# EAGLE design RTC (EAGLE 7.3.0)
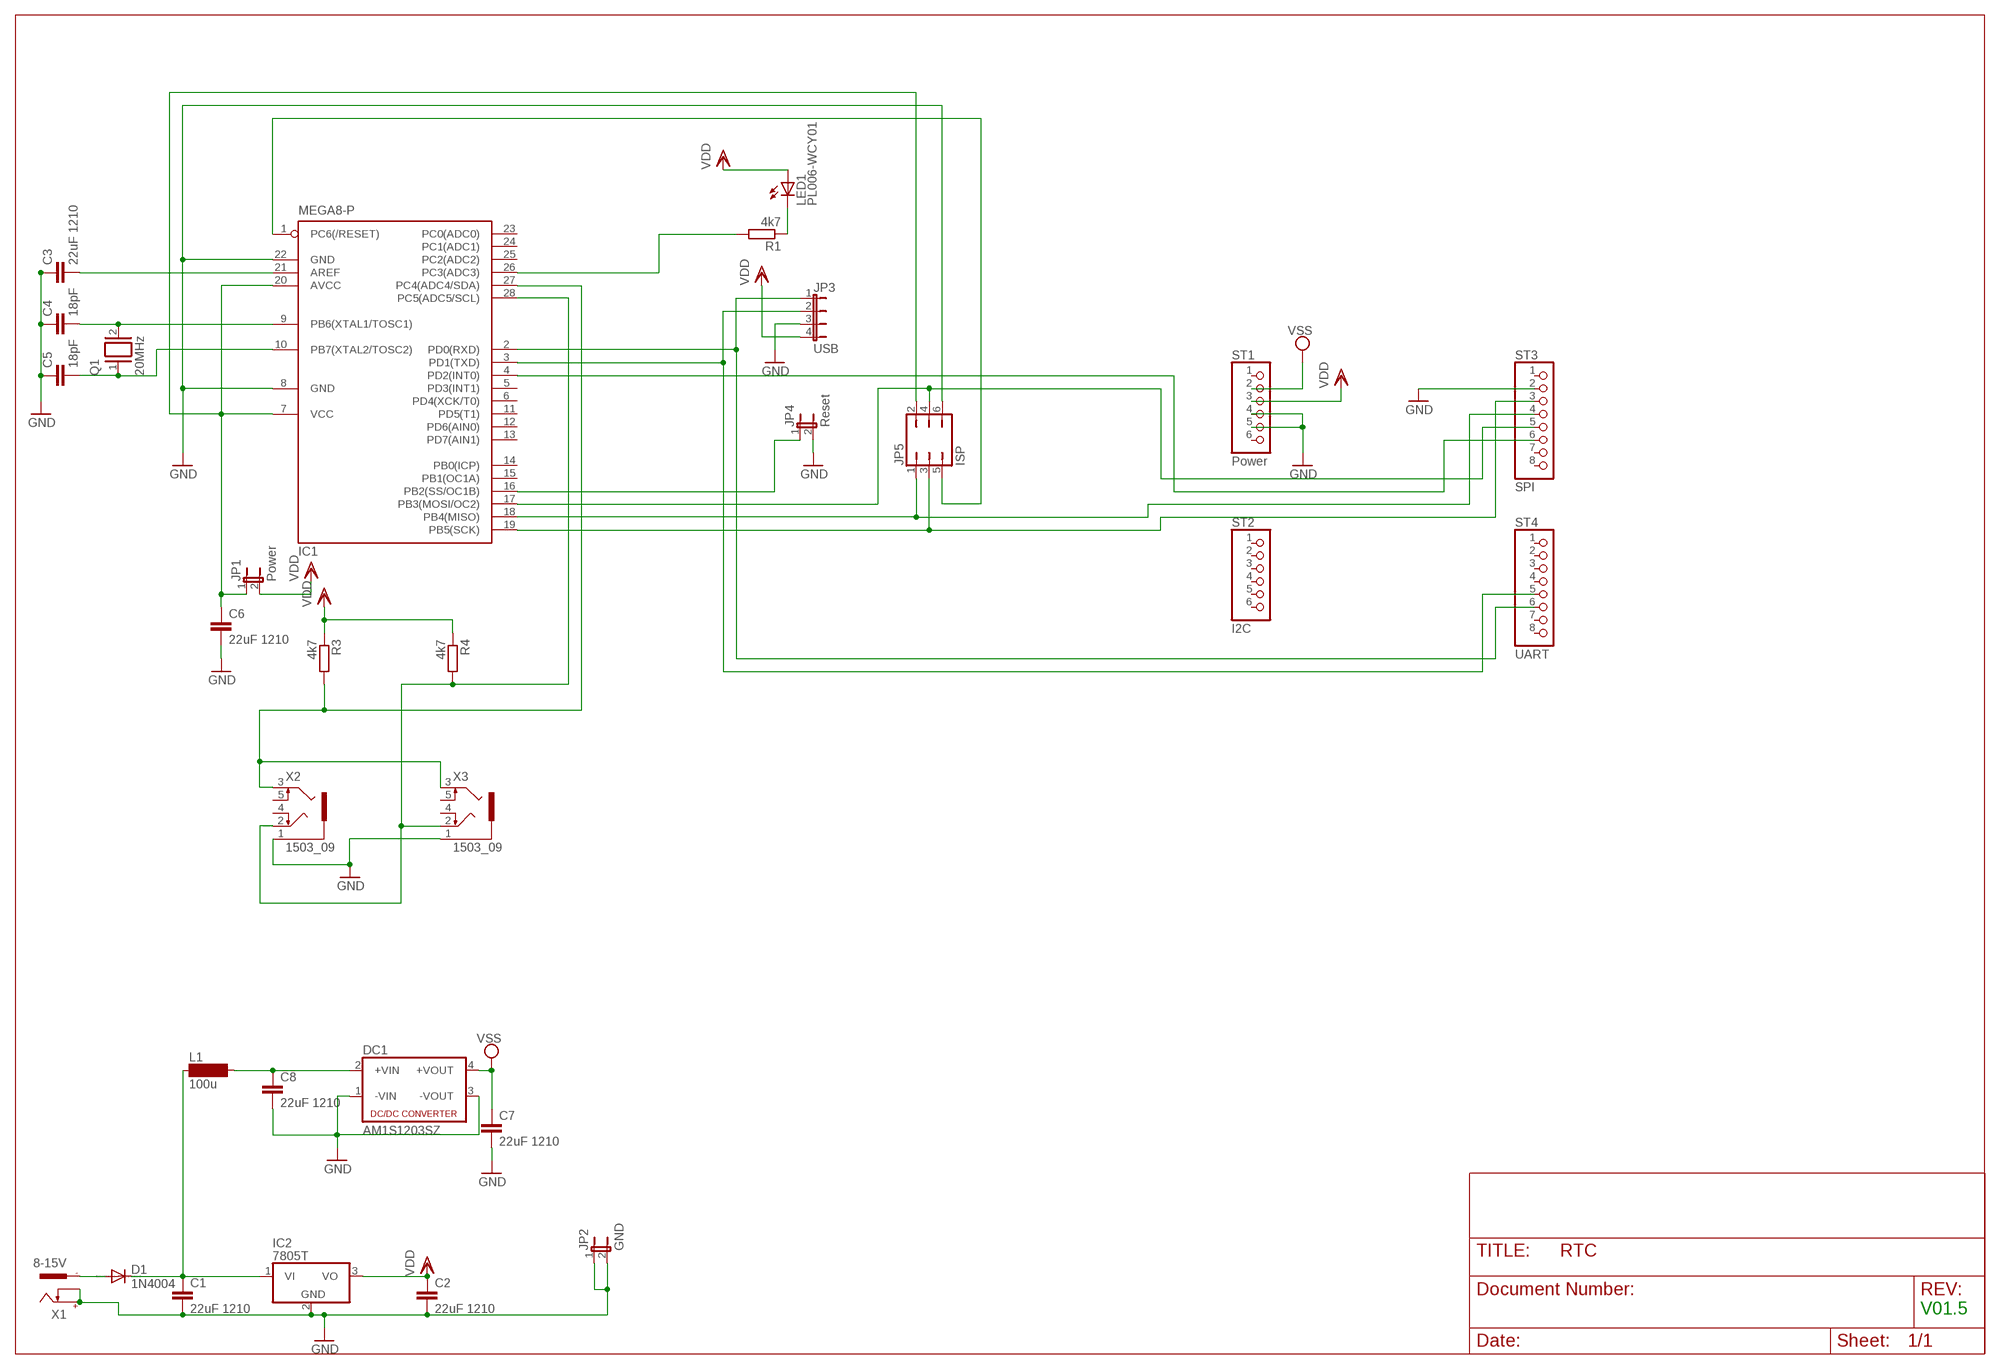
[diagram p0: schematic, sheet 1]

## Parts
C1  22uF 1210  C-EUC1206  [C1206]
C2  22uF 1210  C-EUC1206  [C1206]
C3  22uF 1210  C-EUC1206  [C1206]
C4  18pF  C-EU025-025X050  [C025-025X050]
C5  18pF  C-EU025-025X050  [C025-025X050]
C6  22uF 1210  C-EUC1206  [C1206]
C7  22uF 1210  C-EUC1206  [C1206]
C8  22uF 1210  C-EUC1206  [C1206]
D1  1N4004  [DO41-10]
DC1  AM1S1203SZ  NME  [NME]
IC1  MEGA8-P  [DIL28-3]
IC2  7805T  [TO220H]
JP1  Power  JP1E  [JP1]
JP2  GND  JP1E  [JP1]
JP3  USB  JP4E  [JP4]
JP4  Reset  JP1E  [JP1]
JP5  ISP  JP3Q  [JP3Q]
L1  100u  MS85  [MS85]
LED1  PL006-WCY01  [SOT23]
Q1  20MHz  XTAL/S  [QS]
R1  4k7  R-EU_M1206  [M1206]
R3  4k7  R-EU_R1206  [R1206]
R4  4k7  R-EU_R1206  [R1206]
ST1  Power  PINHD-1X6  [1X06]
ST2  I2C  PINHD-1X6  [1X06]
ST3  SPI  PINHD-1X8  [1X08]
ST4  UART  PINHD-1X8  [1X08]
X1  8-15V  737992-55  [737992-5]
X2  1503_09  [1503_09]
X3  1503_09  [1503_09]

## Nets
GND: C1.2 C2.2 C3.1 C4.1 C5.1 C6.2 C7.2 C8.2 DC1.1(-VIN) DC1.3(-VOUT) IC1.8(GND) IC1.22(GND) IC2.2(GND) JP2.1 JP2.2 JP3.3 JP4.2 JP5.6 ST1.4 ST1.5 ST3.2 X1.+ X1.K X2.1 X3.1
N$1: IC1.26(PC3(ADC3)) R1.2
N$2: IC1.2(PD0(RXD)) JP3.1 ST4.6
N$3: C8.1 DC1.2(+VIN) L1.2
N$4: IC1.4(PD2(INT0)) ST3.6
N$5: IC1.27(PC4(ADC4/SDA)) R3.2 X2.3 X3.3
N$6: IC1.16(PB2(SS/OC1B)) JP4.1
N$12: IC1.3(PD1(TXD)) JP3.2 ST4.5
N$15: IC1.18(PB4(MISO)) JP5.1 ST3.4
N$18: IC1.1(PC6(/RESET)) JP5.5
N$19: C4.2 IC1.9(PB6(XTAL1/TOSC1)) Q1.2
N$20: IC1.19(PB5(SCK)) JP5.3 ST3.3
N$22: IC1.28(PC5(ADC5/SCL)) R4.2 X2.2 X3.2
N$27: D1.A X1.-1
N$28: IC1.17(PB3(MOSI/OC2)) JP5.4 ST3.5
N$33: C1.1 D1.C IC2.1(VI) L1.1
N$35: C3.2 IC1.21(AREF)
N$37: C5.2 IC1.10(PB7(XTAL2/TOSC2)) Q1.1
N$44: C6.1 IC1.7(VCC) IC1.20(AVCC) JP1.1 JP5.2
N$50: LED1.3(C) R1.1
VDD: C2.1 IC2.3(VO) JP1.2 JP3.4 LED1.1(A) R3.1 R4.1 ST1.3
VSS: C7.1 DC1.4(+VOUT) ST1.2
Unconnected: IC1.5(PD3(INT1)) IC1.6(PD4(XCK/T0)) IC1.11(PD5(T1)) IC1.12(PD6(AIN0)) IC1.13(PD7(AIN1)) IC1.14(PB0(ICP)) IC1.15(PB1(OC1A)) IC1.23(PC0(ADC0)) IC1.24(PC1(ADC1)) IC1.25(PC2(ADC2)) ST1.1 ST1.6 ST2.1 ST2.2 ST2.3 ST2.4 ST2.5 ST2.6 ST3.1 ST3.7 ST3.8 ST4.1 ST4.2 ST4.3 ST4.4 ST4.7 ST4.8 X1.-2 X2.4 X2.5 X3.4 X3.5

## Notes on the sheet
- V01.5

## Library data of the parts
C1-C3 C6-C8 = rcl:C-EU: CAPACITOR, European symbol
C4 C5 = resistor:C-EU: CAPACITOR, European symbol
D1 = diode:1N4004: DIODE general purpose rectifier, 1 A
DC1 = dc-dc-converter:NME: DC-DC CONVERTER; MF: C & D TECHNOLOGIES, INC; MPN: NME1205D; OC_FARNELL: 1021466; OC_NEWARK: 98B8198
IC1 = atmel:MEGA8-P: MICROCONTROLLER 8 Kbytes FLASH, 1 kbytes SRAM, 512 bytes EEPROM, USART, 4-channel 10 bit ADC, 2-channel 8 bit ADC Pin compatible with Atmega48, ATMega88, ATMega168 Source: avr.lbr; OC_FARNELL: unknown; OC_NEWARK: unknown
IC2 = linear:78*: Positive VOLTAGE REGULATOR Source: http://cache.national.com/ds/LM/LM78L05.pdf http://www.fairchildsemi.com/ds/LM/LM7805.pdf
JP1 JP2 JP4 = jumper:JP1E: JUMPER
JP3 = jumper:JP4E: JUMPER
JP5 = jumper:JP3Q: JUMPER
L1 = inductor-neosid:MS85: INDUCTOR SMD power inductor; OC_FARNELL: unknown; OC_NEWARK: unknown
LED1 = led:PL006*: PLH006 Series SMD LED SOT23 PLH006-WCR21 Super Red PLH006-WCR12 High Eff Red PLH006-WCG13 Green PLH006-WCY01 Yellow www.p-tec.net Source: http://www.wittig-electronic.de/PTEC/PL006Series.pdf
Q1 = special:XTAL/S: CRYSTAL
R1 R3 R4 = resistor:R-EU_: RESISTOR, European symbol
ST1 ST2 = pinhead:PINHD-1X6: PIN HEADER
ST3 ST4 = pinhead:PINHD-1X8: PIN HEADER
X1 = con-conrad:737992-55: FEMALE PRINT CONNECTOR DIN 45323 (34V/3A), ROKA, distributor Conrad
X2 X3 = con-lumberg:1503_09: Jack connectors according to JISC 6560, 3.5 mm Klinkeneinbaukupplung nach JISC 6560, 3,5 mm, 3-polig/ stereo, abgewinkelte Ausführung, mit 2 Öffnern und Lötaugen, für Leiterplatten Rückseitenmontage Source: http://www.lumberg.com/Produkte/PDFs/1503_09.pdf; OC_FARNELL: 1243244; OC_NEWARK: unknown

## Board
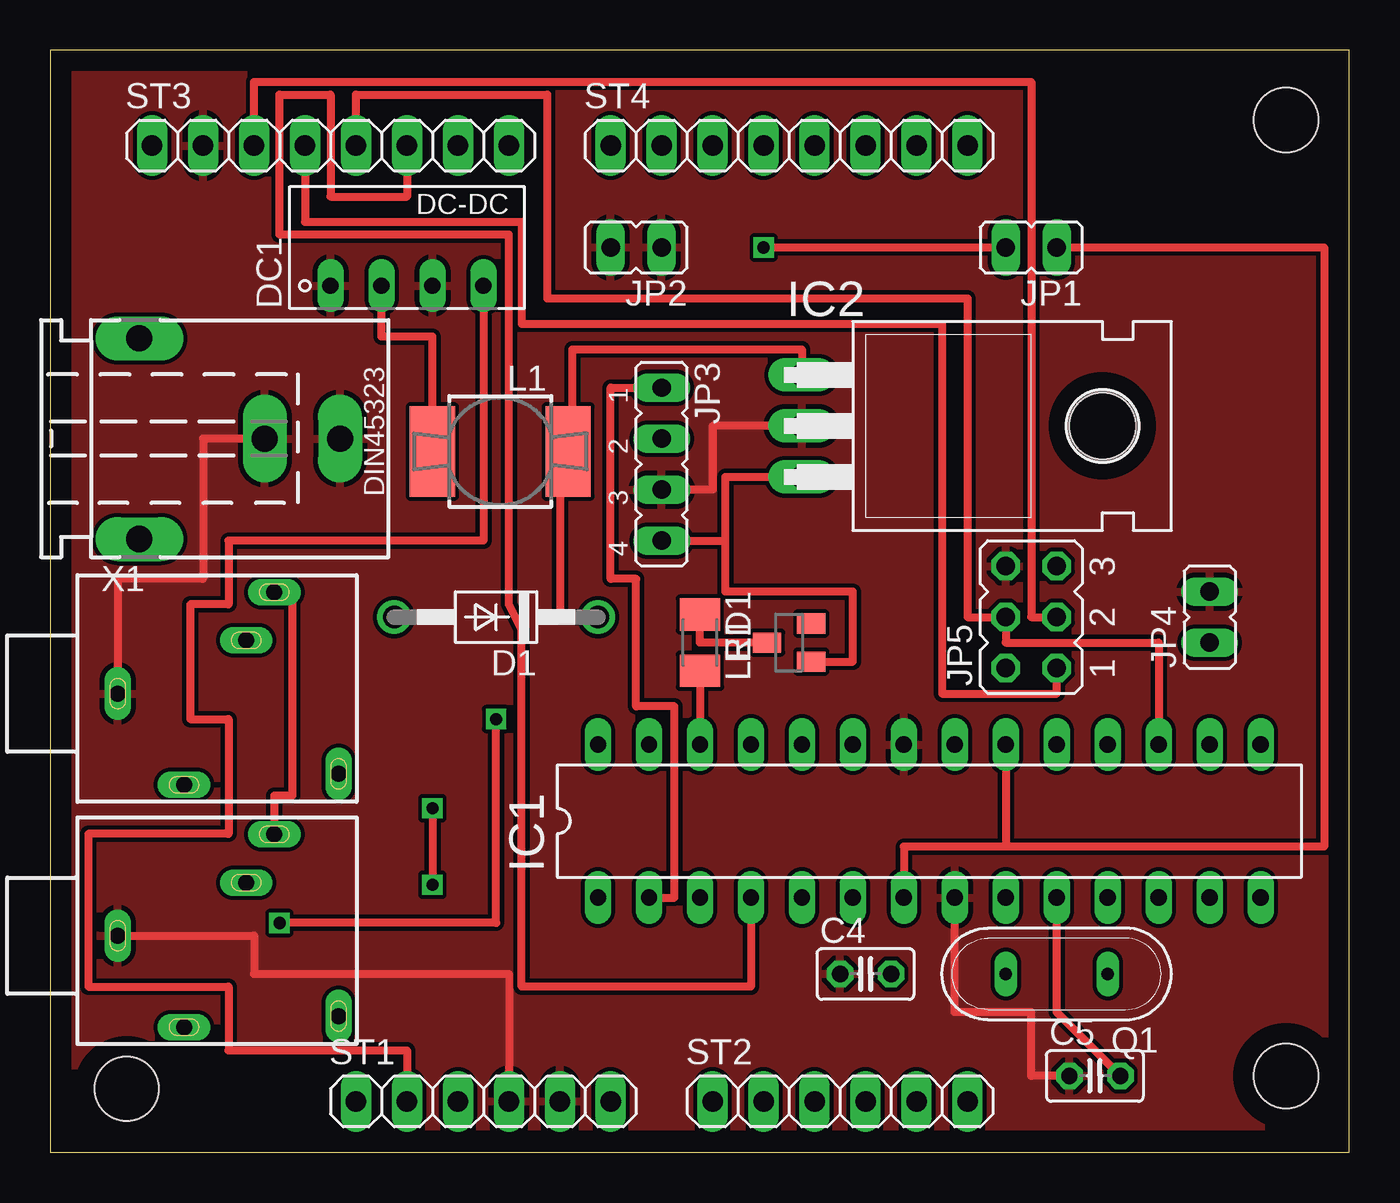
[diagram p1: board, top side]
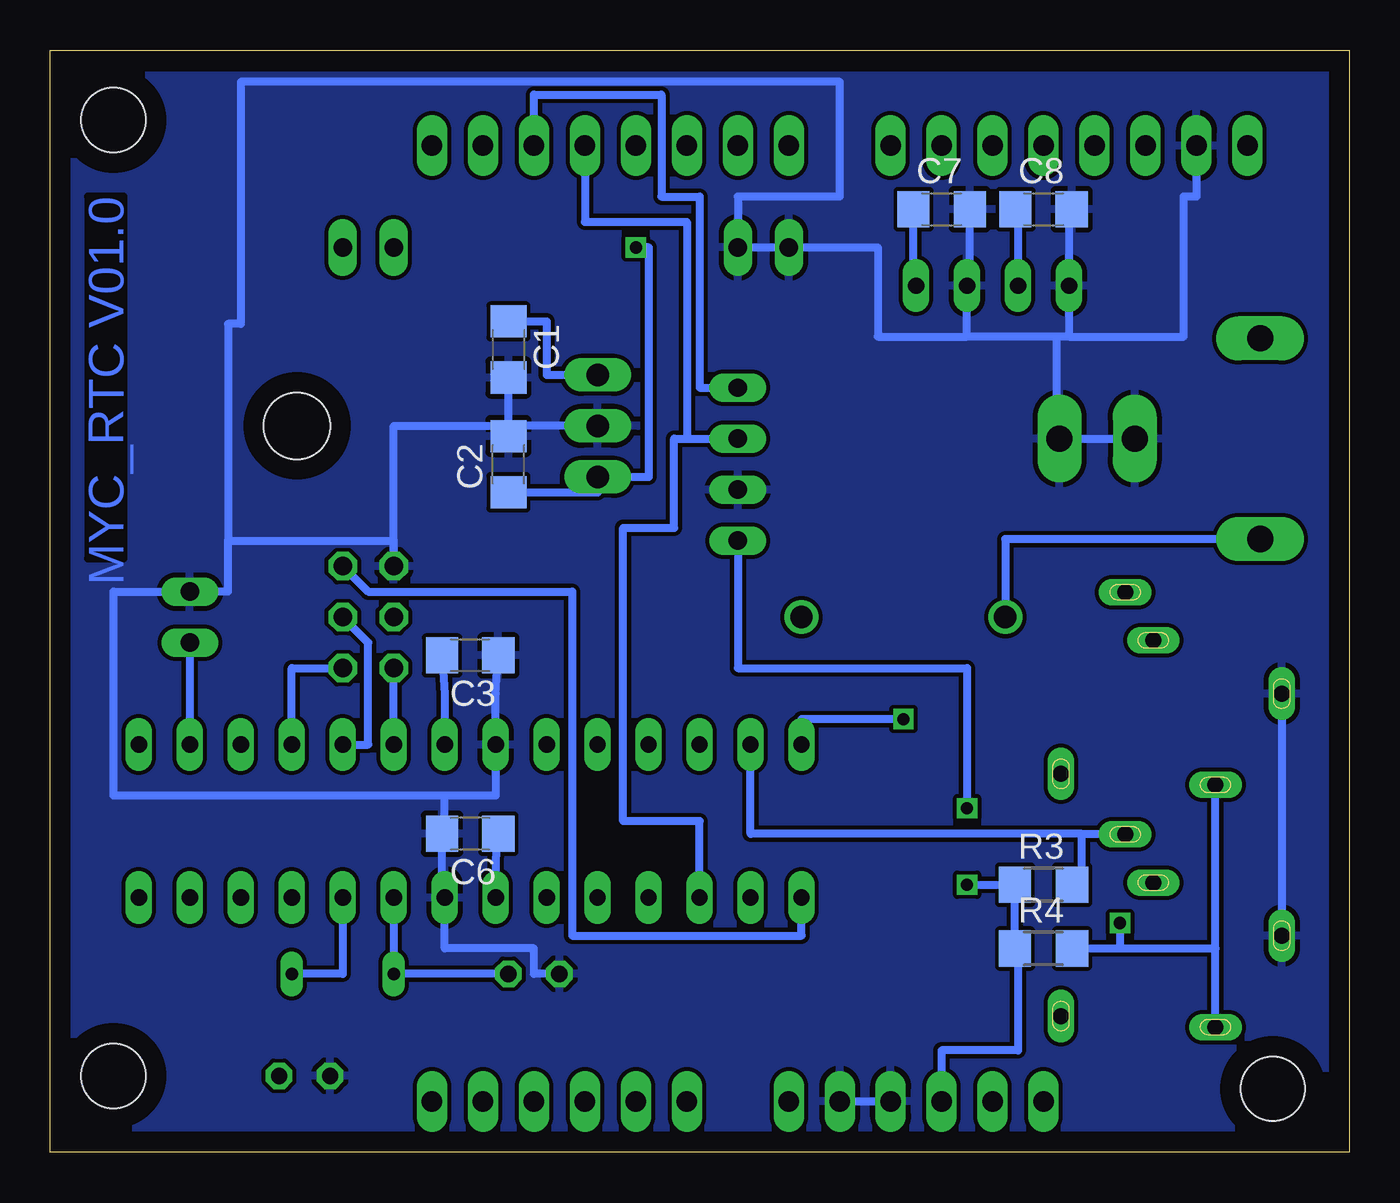
[diagram p2: board, bottom side, seen from below]

Size 64.75 x 54.91 mm. Coordinates in mm from the lower left corner, seen from the top.
Outline: 0,0 64.75,0 64.75,54.91 0,54.91 0,0
Copper layers (1*16): Top 0.035mm / dielectric 1.5mm / Bottom 0.035mm
Design rules "default": minimum track width 10mil, minimum drill 24mil, track to track 8mil, track to pad 8mil, pad to pad 8mil, via to via 8mil, smd to smd 8mil, copper to edge 40mil, drill to drill 8mil, minimum pad ring 10mil, minimum via ring 8mil, stop-mask expansion 4mil, vias tented up to drill 0mil, thermal gap 10mil
Holes 3.2 mm at 61.6,51.44 61.6,3.81 3.81,3.17

### Footprints (pad centres in the part's own frame; a part is rotated, then mirrored left to right if it is on the bottom)
C1206 = smd 1.6 x 1.8: 1 -1.4,0; 2 1.4,0
C025-025X050 = drill 0.813 octagon: 1 -1.27,0; 2 1.27,0
DO41-10 = drill 1.118: A 5.08,0; C -5.08,0
NME = drill 0.813 long: 1 0,3.81; 2 0,1.27; 3 0,-1.27; 4 0,-3.81
DIL28-3 = drill 0.813 long: 1 -16.51,-3.81; 2 -13.97,-3.81; 3 -11.43,-3.81; 4 -8.89,-3.81; 5 -6.35,-3.81; 6 -3.81,-3.81; 7 -1.27,-3.81; 8 1.27,-3.81; 9 3.81,-3.81; 10 6.35,-3.81; 11 8.89,-3.81; 12 11.43,-3.81; 13 13.97,-3.81; 14 16.51,-3.81; 15 16.51,3.81; 16 13.97,3.81; 17 11.43,3.81; 18 8.89,3.81; 19 6.35,3.81; 20 3.81,3.81; 21 1.27,3.81; 22 -1.27,3.81; 23 -3.81,3.81; 24 -6.35,3.81; 25 -8.89,3.81; 26 -11.43,3.81; 27 -13.97,3.81; 28 -16.51,3.81
TO220H = drill 1.118 long: 1 -2.54,-10.16; 2 0,-10.16; 3 2.54,-10.16 | hole 3.302: 0,4.826
JP1 = drill 0.914 long: 1 0,-1.27; 2 0,1.27
JP4 = drill 0.914 long: 1 -3.81,0; 2 -1.27,0; 3 1.27,0; 4 3.81,0
JP3Q = drill 0.914 octagon: 1 -2.54,-1.27; 2 -2.54,1.27; 3 0,-1.27; 4 0,1.27; 5 2.54,-1.27; 6 2.54,1.27
MS85 = smd 4.5 x 2.25: 1 0,-3.383; 2 0,3.383
SOT23 = smd 1 x 1.4: 1 -0.95,-1.1; 2 0.95,-1.1; 3 0,1.1
QS = drill 0.61 long: 1 -2.54,0; 2 2.54,0
M1206 = smd 1.6 x 2: 1 -1.4,0; 2 1.4,0
R1206 = smd 1.6 x 1.803: 1 -1.422,0; 2 1.422,0
1X06 = drill 1.016 long: 1 -6.35,0; 2 -3.81,0; 3 -1.27,0; 4 1.27,0; 5 3.81,0; 6 6.35,0
1X08 = drill 1.016 long: 1 -8.89,0; 2 -6.35,0; 3 -3.81,0; 4 -1.27,0; 5 1.27,0; 6 3.81,0; 7 6.35,0; 8 8.89,0
737992-5 = drill 1.3 pad 2.184 long: + 0,10; -1 5,0; -2 -5,0; K 0,6.25
1503_09 = drill 0.8 pad 1.2 long: 1 0,-2.1; 2 -4.55,-5.4; 3 5.05,-9.9; 4 -4,-13.1; 5 2.65,-8.5

### Placement (x,y rotation side)
C1  41.91,40.01 270 bottom
C2  41.91,34.29 90 bottom
C3  43.82,24.77 180 bottom
C4  40.64,8.89 0 top
C5  52.07,3.81 0 top
C6  43.82,15.88 180 bottom
C7  20.32,46.99 0 bottom
C8  15.24,46.99 0 bottom
D1  22.22,26.67 180 top
DC1  17.78,43.18 90 top
IC1  43.82,16.51 0 top
IC2  47.62,36.2 270 top
JP1  48.9,45.09 90 top
JP2  29.21,45.09 90 top
JP3  30.48,34.29 270 top
JP4  57.79,26.67 0 top
JP5  48.9,26.67 90 top
L1  22.43,34.92 90 top
LED1  36.83,25.4 90 top
Q1  50.17,8.89 180 top
R1  32.38,25.4 270 top
R3  15.24,13.34 0 bottom
R4  15.24,10.16 0 bottom
ST1  21.59,2.54 0 top
ST2  39.37,2.54 0 top
ST3  13.97,50.16 0 top
ST4  36.83,50.16 0 top
X1  4.45,35.56 270 top
X2  1.27,10.79 90 top
X3  1.27,22.86 90 top

### Tracks (layer width: path | path; a pad name or v marks a point on that pad's centre or on a via)
GND
  Top 0.406: X1.K 7.62,35.56 7.62,28.57 3.37,28.57 X3.1 | X2.1 10.16,10.79 10.16,8.89 22.86,8.89 ST1.4 | IC2.2 33.02,36.2 33.02,33.02 JP3.3 | C5.1 48.9,3.81 48.9,6.99 45.09,6.99 IC1.8
  Bottom 0.406: X3.1 X2.1 | ST1.5 ST1.4 | X1.K X1.+ 14.45,37.34 14.61,37.34 14.61,40.64 | ST3.2 7.62,47.62 8.26,47.62 8.26,40.64 13.97,40.64 | C8.2 13.84,47.62 13.97,47.62 DC1.1 13.97,40.64 | 55.88,30.48 55.88,27.94 JP4.2 61.6,27.94 61.6,17.78 45.09,17.78 | 55.88,30.48 47.62,30.48 JP5.6 47.62,36.2 41.91,36.2 | 45.09,17.78 42.55,17.78 IC1.22 42.55,22.86 C3.1 | C7.2 18.92,43.18 DC1.3 19.05,40.64 | 55.88,30.48 55.88,41.27 55.25,41.27 55.25,53.34 25.4,53.34 25.4,47.62 30.48,47.62 JP2.1 JP2.2 23.5,45.09 23.5,40.64 19.05,40.64 | 13.97,40.64 14.61,40.64 | IC2.2 41.91,36.2 | C2.2 41.91,36.2 | 41.91,36.2 C1.2 | 14.61,40.64 19.05,40.64 | C4.1 40.64,8.89 40.64,10.16 45.09,10.16 IC1.8 45.22,12.7 C6.2 45.09,15.88 45.09,17.78
  pour Bottom: 1.27,53.98 64.14,53.98 64.14,46.99 64.14,0.64 0.64,0.64 0.64,3.17 0.64,53.98
  pour Top: 1.27,53.98 63.5,53.98 64.14,53.98 64.14,1.27 1.27,1.27
N$1
  Top 0.406: R1.2 IC1.26
N$2
  Top 0.406: IC1.2 31.11,12.7 31.11,22.23 29.21,22.23 29.21,28.57 27.94,28.57 27.94,38.1 JP3.1
  Bottom 0.406: ST4.6 40.64,52.7 34.29,52.7 34.29,47.62 32.38,47.62 32.38,38.1 JP3.1
N$3
  Top 0.406: L1.2 19.05,40.64 16.51,40.64 DC1.2
  Bottom 0.406: C8.1 16.51,46.99 DC1.2
N$4
  Top 0.406: ST3.6 17.78,47.62 13.97,47.62 13.97,52.7 11.43,52.7 11.43,45.72 22.86,45.72 22.86,27.3 23.5,26.04 23.5,8.26 34.93,8.26 IC1.4
N$5
  Top 0.406: X3.3 11.17,27.94 12.06,27.94 12.06,17.78 11.17,17.78 X2.3
  Bottom 0.406: 12.06,27.94 11.17,27.94 X3.3 | R3.2 13.33,13.34 13.33,15.88 | 13.33,15.88 11.17,15.88 X2.3 | 13.33,15.88 29.84,15.88 IC1.27
N$6
  Bottom 0.406: JP4.1 IC1.16
N$12
  Bottom 0.406: ST4.5 38.1,46.35 33.02,46.35 33.02,35.56 | 33.02,35.56 JP3.2 | IC1.3 32.38,16.51 36.2,16.51 36.2,31.11 33.66,31.11 33.66,35.56 33.02,35.56
N$15
  Top 0.406: ST3.4 12.7,46.35 23.5,46.35 23.5,41.27 44.45,41.27 44.45,22.86 50.17,22.86 JP5.1
  Bottom 0.406: IC1.18 52.71,24.13 JP5.1
N$18
  Bottom 0.406: JP5.5 48.9,27.94 38.74,27.94 38.74,10.79 27.3,10.79 IC1.1
N$19
  Bottom 0.406: IC1.9 Q1.2 C4.2
N$20
  Top 0.406: ST3.3 10.16,53.34 48.9,53.34 48.9,26.67 JP5.3
  Bottom 0.406: IC1.19 48.9,20.32 48.9,25.4 JP5.3
N$22  (via drill 0.6)
  Top 0.406: v22.22,21.59 22.22,11.43 v11.43,11.43
  Bottom 0.406: X2.2 6.67,10.16 | 6.67,10.16 X3.2 | 11.43,10.16 6.67,10.16 | R4.2 11.43,10.16 | v22.22,21.59 27.3,21.59 IC1.28 | v11.43,11.43 11.43,10.16
N$27
  Bottom 0.406: X1.-1 17.14,30.56 D1.A
N$28
  Top 0.406: ST3.5 15.24,52.7 24.77,52.7 24.77,42.55 45.72,42.55 45.72,26.67 JP5.4 47.62,25.4 55.25,25.4 IC1.17
N$33
  Top 0.406: D1.C 25.4,26.67 25.4,34.92 L1.1 26.04,35.14 26.04,40.01 37.47,40.01 IC2.1
  Bottom 0.406: C1.1 40.01,41.41 40.01,38.73 IC2.1
N$35
  Bottom 0.406: C3.2 45.09,22.86 IC1.21
N$37
  Top 0.406: C5.2 50.17,6.99 IC1.10
  Bottom 0.406: IC1.10 50.17,8.89 Q1.1
N$44
  Top 0.406: JP1.1 63.5,45.09 63.5,15.24 47.62,15.24 | 47.62,15.24 42.55,15.24 IC1.7 | IC1.20 47.62,15.24
  Bottom 0.406: C6.1 42.55,14.61 IC1.7 | IC1.20 JP5.2
N$50
  Top 0.406: LED1.3 32.38,25.4 R1.1
VDD  (via drill 0.6)
  Top 0.406: LED1.1 40.01,24.45 40.01,27.94 33.66,27.94 33.66,30.48 | v35.56,45.09 JP1.2 | 33.66,30.48 33.66,33.66 IC2.3 | JP3.4 33.66,30.48 | v19.05,17.14 v19.05,13.34
  Bottom 0.406: ST1.3 20.32,5.08 16.51,5.08 16.51,10.16 R4.1 R3.1 v19.05,13.34 | v35.56,45.09 34.93,45.09 34.93,33.66 IC2.3 37.47,32.89 C2.1 | JP3.4 30.48,24.13 19.05,24.13 v19.05,17.14
VSS
  Top 0.406: DC1.4 21.59,30.48 8.89,30.48 8.89,27.3 6.98,27.3 6.98,21.59 8.89,21.59 8.89,15.88 1.91,15.88 1.91,8.26 8.89,8.26 8.89,5.08 17.78,5.08 17.78,3.81 17.78,3.17 ST1.2
  Bottom 0.406: DC1.4 21.72,43.18 C7.1

### Text on the board
Bottom: MYC_RTC V01.0